# EAGLE board EARM01 (EAGLE 7.2.0)
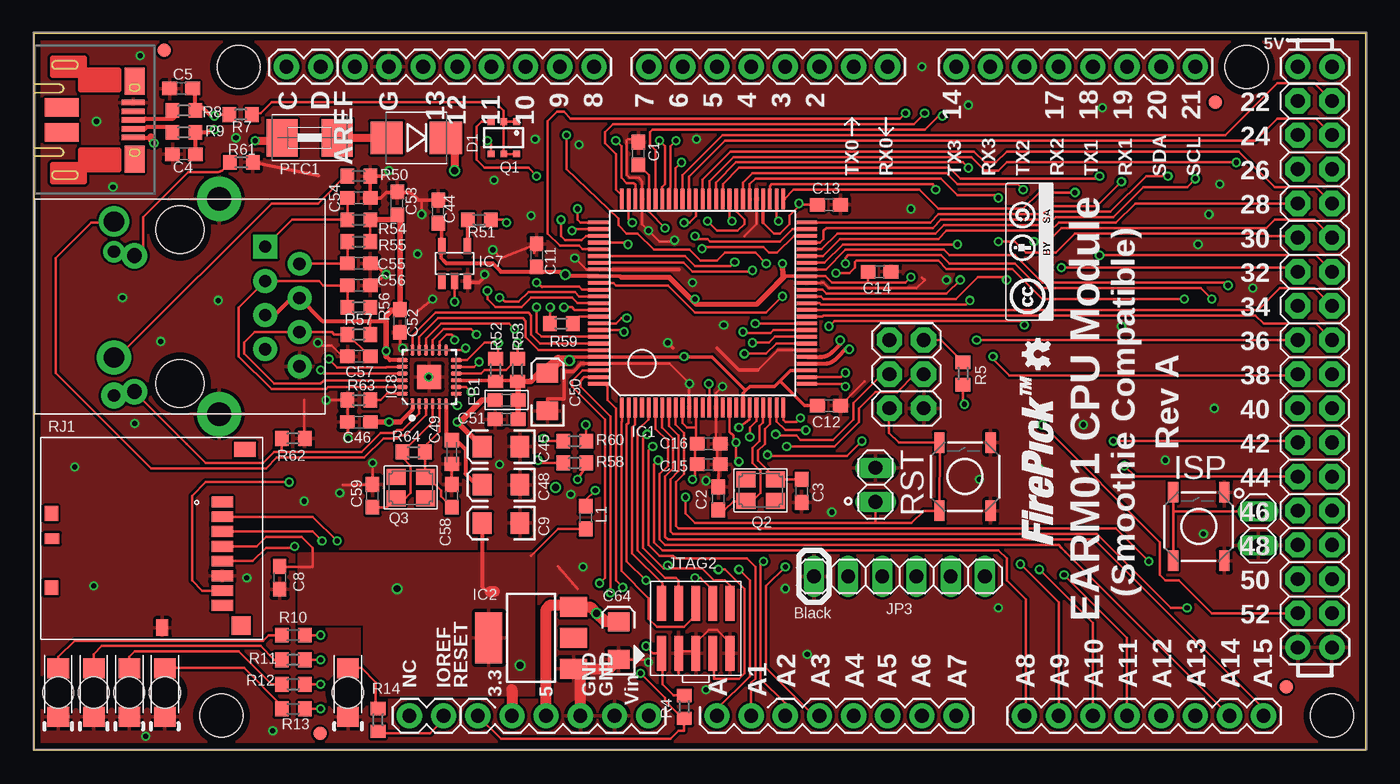
[diagram p2: board, top side]
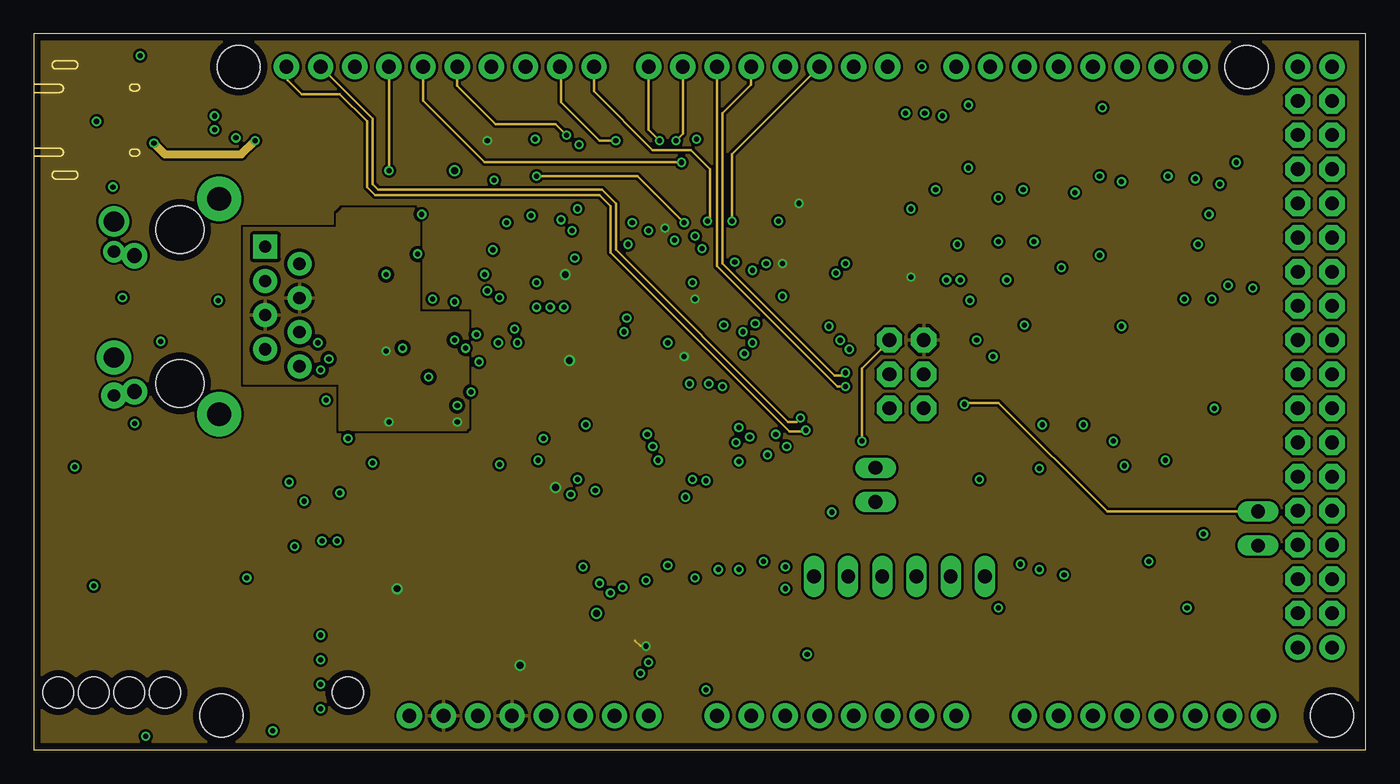
[diagram p3: board, inner layer 3.3]
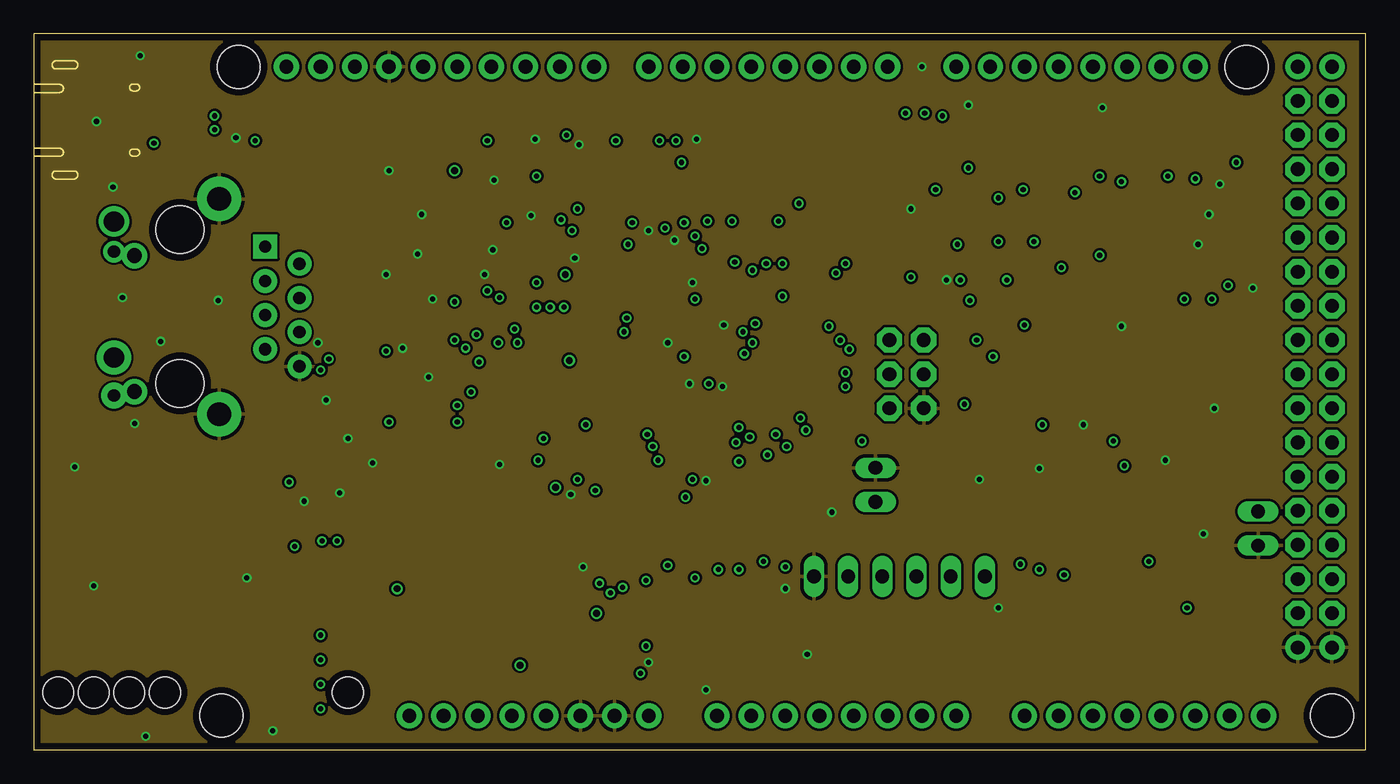
[diagram p4: board, inner layer Gnd]
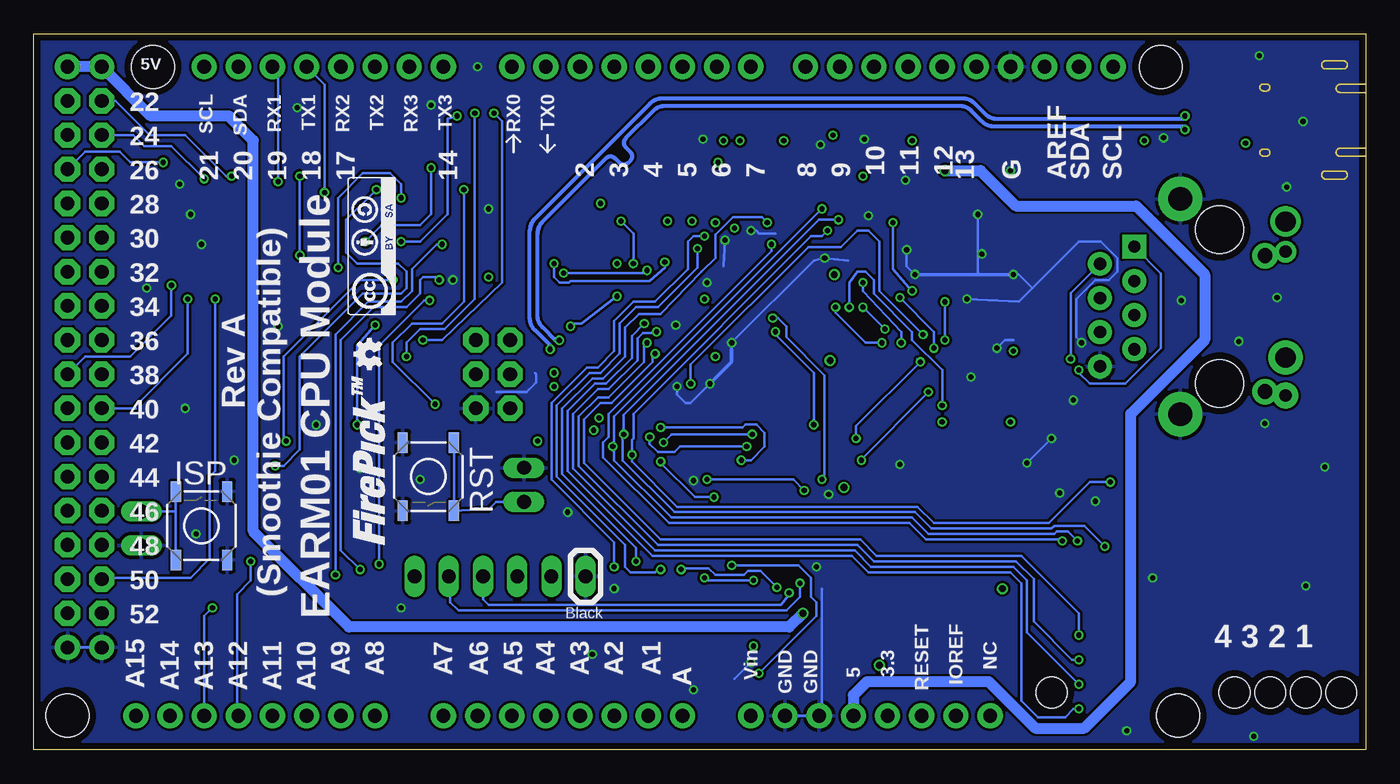
[diagram p5: board, bottom side, seen from below]

Size 99.04 x 53.26 mm. Coordinates in mm from the lower left corner, seen from the top.
Outline: 0,0 99.04,0 99.04,53.26 0,53.26 0,0
Copper layers (1*2*3*16): Top 0.035mm / dielectric 1.5mm / 3.3 0.035mm / dielectric 0.15mm / Gnd 0.035mm / dielectric 0.2mm / Bottom 0.035mm
Design rules "EagleRules": minimum track width 7mil, minimum drill 12mil, track to track 7mil, track to pad 7mil, pad to pad 7mil, via to via 7mil, smd to smd 0mil, copper to edge 20mil, drill to drill 10mil, minimum pad ring 10mil, minimum via ring 6mil, stop-mask expansion 2mil, vias tented up to drill 25mil, thermal gap 10mil
Net classes: 1 USB: width 0.305 mm, drill 0.381 mm, clearance 0.254 mm

## Footprints (pad centres in the part's own frame; a part is rotated, then mirrored left to right if it is on the bottom)
C0603 = smd 1.1 x 1: 1 -0.85,0; 2 0.85,0
EIA3216 = smd 1.4 x 1.6: A 1.4,0; C -1.4,0
C0603K = smd 1.05 x 1.08: 1 -0.875,0; 2 0.875,0
SMB-DIODE = smd 2.4 x 2.4: A 2.2,0; C -2.2,0
0603 = smd 1.1 x 1: 1 -0.85,0; 2 0.85,0
FIDUCIAL-1X2 = smd 1 x 1: 1 0,0
LQFP100 = smd 0.27 x 1.5: 1 -6,-7.75; 2 -5.5,-7.75; 3 -5,-7.75; 4 -4.5,-7.75; 5 -4,-7.75; 6 -3.5,-7.75; 7 -3,-7.75; 8 -2.5,-7.75; 9 -2,-7.75; 10 -1.5,-7.75; 11 -1,-7.75; 12 -0.5,-7.75; 13 0,-7.75; 14 0.5,-7.75; 15 1,-7.75; 16 1.5,-7.75; 17 2,-7.75; 18 2.5,-7.75; 19 3,-7.75; 20 3.5,-7.75; 21 4,-7.75; 22 4.5,-7.75; 23 5,-7.75; 24 5.5,-7.75; 25 6,-7.75; 51 6,7.75; 52 5.5,7.75; 53 5,7.75; 54 4.5,7.75; 55 4,7.75; 56 3.5,7.75; 57 3,7.75; 58 2.5,7.75; 59 2,7.75; 60 1.5,7.75; 61 1,7.75; 62 0.5,7.75; 63 0,7.75; 64 -0.5,7.75; 65 -1,7.75; 66 -1.5,7.75; 67 -2,7.75; 68 -2.5,7.75; 69 -3,7.75; 70 -3.5,7.75; 71 -4,7.75; 72 -4.5,7.75; 73 -5,7.75; 74 -5.5,7.75; 75 -6,7.75 | smd 1.5 x 0.27: 26 7.75,-6; 27 7.75,-5.5; 28 7.75,-5; 29 7.75,-4.5; 30 7.75,-4; 31 7.75,-3.5; 32 7.75,-3; 33 7.75,-2.5; 34 7.75,-2; 35 7.75,-1.5; 36 7.75,-1; 37 7.75,-0.5; 38 7.75,0; 39 7.75,0.5; 40 7.75,1; 41 7.75,1.5; 42 7.75,2; 43 7.75,2.5; 44 7.75,3; 45 7.75,3.5; 46 7.75,4; 47 7.75,4.5; 48 7.75,5; 49 7.75,5.5; 50 7.75,6; 76 -7.75,6; 77 -7.75,5.5; 78 -7.75,5; 79 -7.75,4.5; 80 -7.75,4; 81 -7.75,3.5; 82 -7.75,3; 83 -7.75,2.5; 84 -7.75,2; 85 -7.75,1.5; 86 -7.75,1; 87 -7.75,0.5; 88 -7.75,0; 89 -7.75,-0.5; 90 -7.75,-1; 91 -7.75,-1.5; 92 -7.75,-2; 93 -7.75,-2.5; 94 -7.75,-3; 95 -7.75,-3.5; 96 -7.75,-4; 97 -7.75,-4.5; 98 -7.75,-5; 99 -7.75,-5.5; 100 -7.75,-6
SOT223 = smd 1.5 x 2: 1 -2.3,-3.15; 2 0,-3.15; 3 2.3,-3.15 | smd 3.8 x 2: 4 0,3.15
SOT23-5 = smd 0.55 x 1.2: 1 -0.95,-1.3; 2 0,-1.3; 3 0.95,-1.3; 4 0.95,1.3; 5 -0.95,1.3
QFN24_4MM = smd 0.8 x 0.28: 1 -2,1.25; 2 -2,0.75; 3 -2,0.25; 4 -2,-0.25; 5 -2,-0.75; 6 -2,-1.25; 13 2,-1.25; 14 2,-0.75; 15 2,-0.25; 16 2,0.25; 17 2,0.75; 18 2,1.25 | smd 0.28 x 0.8: 7 -1.25,-2; 8 -0.75,-2; 9 -0.25,-2; 10 0.25,-2; 11 0.75,-2; 12 1.25,-2; 19 1.25,2; 20 0.75,2; 21 0.25,2; 22 -0.25,2; 23 -0.75,2; 24 -1.25,2 | smd 1.778 x 1.778: THERM 0,0
1X02 = drill 1.016 long: 1 -1.27,0; 2 1.27,0
1X06 = drill 1.016 long: 1 -6.35,0; 2 -3.81,0; 3 -1.27,0; 4 1.27,0; 5 3.81,0; 6 6.35,0
MICRO-USB-FCI-10103592 = smd 0.4 x 1.71: 1 3.84,2.51; 2 3.19,2.51; 3 2.54,2.51; 4 1.89,2.51; 5 1.24,2.51 | smd 2 x 1.46: 7 -0.36,2.64; 17 5.44,2.64 | smd 1.375 x 2.5: 11 1.603,-2.79; 12 3.478,-2.79
2X05_1.27MM_SMT = smd 0.65 x 2.6: 1 -2.54,-1.85; 2 -2.54,1.85; 3 -1.27,-1.85; 4 -1.27,1.85; 5 0,-1.85; 6 0,1.85; 7 1.27,-1.85; 8 1.27,1.85; 9 2.54,-1.85; 10 2.54,1.85
LED-1206-BOTTOM = smd 1.5 x 1.6: A -1.8,0; C 1.8,0 | hole 2.3: 0,0
1812 = smd 2.286 x 2.794: 1 -2.046,0; 2 2.046,0
SC74_INFINEON = smd 0.5 x 0.5: 1 -0.95,-1.2; 2 0,-1.2; 3 0.95,-1.2; 4 0.95,1.2; 5 0,1.2; 6 -0.95,1.2
CRYSTAL_3.2X2.5 = smd 1.4 x 1.2: 1 -1.1,-0.8; 2 1.1,0.8; GND1 -1.1,0.8; GND2 1.1,-0.8
R0603 = smd 1 x 1.1: 1 -0.85,0; 2 0.85,0
HR911105A = drill 1.5: G+ 6.325,4.9 | drill 0.9 pad 1.6: G- 4.085,4.9 | drill 1.1 pad 1.9: G-- 3.785,3.38; Y++ -6.325,3.38 | drill 0.9 pad 1.778: GND -4.445,-8.89; NC -3.175,-6.35; P4 0.635,-8.89; P5 -0.635,-6.35; RD+ 1.905,-6.35; RD- -1.905,-8.89; TD- 3.175,-8.89 | drill 1.76 pad 3.3: SHIELD0 -8.001,-2.921; SHIELD1 8.001,-2.921 | drill 0.9 pad 1.778 square: TD+ 4.445,-6.35 | drill 0.9 pad 1.93: Y+ -6.625,4.9 | drill 1.5 pad 2.54: Y- -3.785,4.9 | hole 3.556: 5.715,0; -5.715,0
TACTILE_SWITCH_SMD = smd 1.524 x 0.762: 1 -2.54,1.905; 2 2.54,1.905; 3 -2.54,-1.905; 4 2.54,-1.905
ARDUINO_MEGA_NEW = drill 1.016 pad 1.88: 0 63.5,50.8; 1 60.96,50.8; 2 58.42,50.8; 3 55.88,50.8; 3.3V 35.56,2.54; 4 53.34,50.8; 5 50.8,50.8; 5V 38.1,2.54; 5V@1 93.98,50.8; 5V@2 96.52,50.8; 6 48.26,50.8; 7 45.72,50.8; 8 41.656,50.8; 9 39.116,50.8; 10 36.576,50.8; 11 34.036,50.8; 12 31.496,50.8; 13 28.956,50.8; 14 68.58,50.8; 15 71.12,50.8; 16 73.66,50.8; 17 76.2,50.8; 18 78.74,50.8; 19 81.28,50.8; 20 83.82,50.8; 21 86.36,50.8; A0 50.8,2.54; A1 53.34,2.54; A2 55.88,2.54; A3 58.42,2.54; A4 60.96,2.54; A5 63.5,2.54; A6 66.04,2.54; A7 68.58,2.54; A8 73.66,2.54; A9 76.2,2.54; A10 78.74,2.54; A11 81.28,2.54; A12 83.82,2.54; A13 86.36,2.54; A14 88.9,2.54; A15 91.44,2.54; AREF 23.876,50.8; GND 26.416,50.8; GND@0 40.64,2.54; GND@1 43.18,2.54; GND@2 93.98,7.62; GND@3 96.52,7.62; IOREF 30.48,2.54; NC 27.94,2.54; RESET 33.02,2.54; SCL1 18.796,50.8; SDA1 21.336,50.8; VIN 45.72,2.54 | drill 1.016 pad 1.88 octagon: 22 93.98,48.26; 23 96.52,48.26; 24 93.98,45.72; 25 96.52,45.72; 26 93.98,43.18; 27 96.52,43.18; 28 93.98,40.64; 29 96.52,40.64; 30 93.98,38.1; 31 96.52,38.1; 32 93.98,35.56; 33 96.52,35.56; 34 93.98,33.02; 35 96.52,33.02; 36 93.98,30.48; 37 96.52,30.48; 38 93.98,27.94; 39 96.52,27.94; 40 93.98,25.4; 41 96.52,25.4; 42 93.98,22.86; 43 96.52,22.86; 44 93.98,20.32; 45 96.52,20.32; 46 93.98,17.78; 47 96.52,17.78; 48 93.98,15.24; 49 96.52,15.24; 50 93.98,12.7; 51 96.52,12.7; 52 93.98,10.16; 53 96.52,10.16; GNDI 66.167,25.4; MISO 63.627,30.48; MOSI 66.167,27.94; RST 63.627,25.4; SCK 63.627,27.94; VCC 66.167,30.48 | hole 3.2: 15.24,50.8; 13.97,2.54; 90.17,50.8; 96.52,2.54
ST9S008V4AR1500 = smd 0.8 x 1.6: 1 3.2,0; 2 2.1,0; 3 1,0; 4 -0.1,0; 5 -1.2,0; 6 -2.3,0; 7 -3.4,0; 8 -4.5,0 | smd 1.2 x 0.9: ID -6.15,4.45 | smd 1.4 x 1.4: P$9 -6,-1.4 | smd 1.1 x 1.6: P$10 7.1,-1.7 | smd 1.1 x 1: P$12 -3.18,12.7; P$13 2.35,12.7 | smd 0.8 x 1.1: P$14 0.46,12.65

## Placement (x,y rotation side)
C1  .1uF  [C0603]  44.96,44.35 270 top
C2  18pF  [C0603]  50.9,18.69 90 top
C3  18pF  [C0603]  57.1,19.25 270 top
C4  18pF  [C0603]  11.18,44.3 0 top
C5  18pF  [C0603]  10.97,49.17 0 top
C8  .1uF  [C0603]  18.29,12.8 270 top
C9  10uF  [EIA3216]  34.75,16.87 180 top
C11  .1uF  [C0603]  37.39,36.78 270 top
C12  .1uF  [C0603]  59.13,25.6 180 top
C13  .1uF  [C0603]  59.13,40.54 180 top
C14  .1uF  [C0603]  62.89,35.56 180 top
C15  .1uF  [C0603]  50.19,21.23 180 top
C16  .1uF  [C0603]  50.19,22.76 0 top
C44  .1uF  [C0603]  30.07,40.03 90 top
C45  10uF  [EIA3216]  34.75,22.56 180 top
C46  .1uF  [C0603]  24.18,24.38 180 top
C48  1uF  [EIA3216]  34.75,19.71 180 top
C49  470pF  [C0603K]  31.09,22.15 270 top
C50  10uF  [EIA3216]  38.2,26.62 90 top
C51  .1uF  [C0603]  35.15,24.59 180 top
C52  .1uF  [C0603]  27.23,31.9 270 top
C53  .1uF  [C0603]  27.03,40.64 90 top
C54  18pF  [C0603]  24.18,41.05 0 top
C55  18pF  [C0603]  24.18,36.17 0 top
C56  18pF  [C0603]  24.18,34.54 0 top
C57  18pF  [C0603]  24.18,29.26 180 top
C58  18pF  [C0603]  31.09,18.9 90 top
C59  18pF  [C0603]  25.2,18.9 90 top
C64  10uF  [EIA3216]  43.48,8.13 90 top
D1  DIODE-SMB  [SMB-DIODE]  28.45,45.52 180 top
FB1  [0603]  35.15,26.01 180 top
FID5  FIDUCIAL1X2  [FIDUCIAL-1X2]  93.12,4.67 0 top
FID6  FIDUCIAL1X2  [FIDUCIAL-1X2]  21.29,1.22 0 top
FID17  FIDUCIAL1X2  [FIDUCIAL-1X2]  87.83,48.16 0 top
FID18  FIDUCIAL1X2  [FIDUCIAL-1X2]  9.7,52.02 0 top
IC1  LPC1769  [LQFP100]  49.73,33.22 0 top
IC2  LD1117  [SOT223]  36.98,8.33 90 top
IC7  [SOT23-5]  31.29,36.17 0 top
IC8  [QFN24_4MM]  29.41,27.74 90 top
JP1  [1X02]  62.59,19.71 270 top
JP2  [1X02]  91.03,16.46 270 top
JP3  [1X06]  64.36,12.9 0 top
JP4  MICRO-USB-FCI-10103592  [MICRO-USB-FCI-10103592]  4.88,49.38 270 top
JTAG2  [2X05_1.27MM_SMT]  49.23,9.04 0 top
L1  [0603]  41.05,17.27 270 top
LED1  [LED-1206-BOTTOM]  1.83,4.27 270 top
LED2  [LED-1206-BOTTOM]  4.47,4.27 270 top
LED3  [LED-1206-BOTTOM]  7.11,4.27 270 top
LED4  [LED-1206-BOTTOM]  9.75,4.27 270 top
LED5  [LED-1206-BOTTOM]  23.37,4.27 270 top
LOGO1  LOGO-FIREPICKMEDIUM  [LOGO-FIREPICK-MEDIUM]  72.95,15.24 90 bottom
LOGO2  LOGO-OSHWSMALL  [LOGO-OSHW-SMALL]  72.95,28.19 90 bottom
LOGO3  LOGO-CC-BY-SAMEDIUM  [LOGO-CC-BY-SA-MEDIUM]  72.14,32.36 90 bottom
LOGO4  LOGO-FIREPICKMEDIUM  [LOGO-FIREPICK-MEDIUM]  75.79,15.24 90 top
LOGO6  LOGO-CC-BY-SAMEDIUM  [LOGO-CC-BY-SA-MEDIUM]  75.79,31.95 90 top
LOGO10  LOGO-OSHWSMALL  [LOGO-OSHW-SMALL]  75.79,28.19 90 top
PTC1  [1812]  20.52,45.52 180 top
Q1  BSL207SP  [SC74_INFINEON]  34.95,45.52 180 top
Q2  12MHz  [CRYSTAL_3.2X2.5]  54.05,19.3 180 top
Q3  25MHz  [CRYSTAL_3.2X2.5]  28.04,19.51 0 top
R4  10k  [R0603]  48.36,3.2 90 top
R5  10k  [R0603]  69.09,27.99 90 top
R7  1.5K  [R0603]  15.39,47.24 0 top
R8  33R  [R0603]  11.18,47.55 0 top
R9  33R  [R0603]  11.18,45.92 0 top
R10  1k  [R0603]  19.3,8.53 0 top
R11  1k  [R0603]  19.3,6.71 0 top
R12  1k  [R0603]  19.3,4.88 0 top
R13  1k  [R0603]  19.3,3.05 0 top
R14  1k  [R0603]  25.6,2.24 270 top
R50  330R  [R0603]  24.18,42.67 180 top
R51  22R  [R0603]  33.12,39.42 0 top
R52  1.5K  [R0603]  34.34,28.24 270 top
R53  10K  [R0603]  35.97,28.24 270 top
R54  49.9R  [R0603]  24.18,39.42 180 top
R55  49.9R  [R0603]  24.18,37.8 180 top
R56  49.9R  [R0603]  24.18,32.92 180 top
R57  49.9R  [R0603]  24.18,30.89 180 top
R58  22R  [R0603]  40.23,21.34 0 top
R59  22R  [R0603]  39.22,31.7 0 top
R60  22R  [R0603]  40.23,22.96 0 top
R61  330R  [R0603]  15.44,43.69 180 top
R62  10K  [R0603]  19.3,23.16 180 top
R63  12.1K  [R0603]  24.18,26.01 0 top
R64  1M  [R0603]  28.24,22.15 180 top
RJ1  HR911105A  [HR911105A]  10.87,32.97 90 top
S1  [TACTILE_SWITCH_SMD]  69.24,20.32 90 top
S2  [TACTILE_SWITCH_SMD]  86.61,16.61 90 top
S3  [TACTILE_SWITCH_SMD]  69.7,20.32 270 bottom
S4  [TACTILE_SWITCH_SMD]  86.56,16.66 90 bottom
U1  ARDUINO-MEGA  [ARDUINO_MEGA_NEW]  0,0 0 top
X1  ST9S008V4AR1500  [ST9S008V4AR1500]  14.02,15.24 90 top

## Tracks (layer width: path | path; a pad name or v marks a point on that pad's centre or on a via)
3.3V  (via drill 0.38, 0.51)
  Top 0.203: 33.73,11.99 33.93,11.79 33.93,11.58 33.36,12.15 | 33.93,8.43 IC2.4 | R4.2 47.56,4.05 46.74,4.88 46.74,7.14 JTAG2.1 46.05,7.19 v45.52,7.72 | IC1.42 58.86,35.22 59.33,34.75 61.98,34.75 | 55.85,35.22 55.75,35.22 | C1.2 45.73,42.72 IC1.71 45.73,40.02 v46.94,38.81 | 54.23,39.22 55.05,38.41 55.47,38.41 56.19,39.12 56.19,39.73 56.9,40.44 | 56.9,40.44 v56.9,40.64 | 56.9,40.44 57,40.54 C13.2 | 47.75,34.65 47.8,34.59 | 49.28,33.12 49.28,33.43 v49.17,33.53 | U1.VCC 67.45,30.48 R5.2 | 61.98,34.75 64.82,34.75 v65.23,35.15 | Q1.4 34,45.04 v33.73,45.31 | C14.2 62.04,34.81 61.98,34.75 | U1.IOREF 30.48,2.23 29.46,1.22 25.77,1.22 R14.2 | X1.4 16.56,15.14 17.27,15.85 19.91,15.85 20.73,15.04 20.73,13.61 18.32,13.61 C8.1 | L1.2 38.98,16.42 36.98,14.43
  Top 0.254: IC8.9 34.34,27.49 | 34.34,27.49 35.87,27.49 R53.2 | R52.2 34.34,27.49 | 30.48,36.37 30.28,36.58 30.28,37.4 IC7.5 30.34,38.91 C44.1 | v39.83,28.96 40.09,29.22 IC1.96 50.43,29.22 52.93,26.72 | C12.2 57.3,25.6 55.47,27.43 | IC1.19 52.73,26.52 52.93,26.72 | 52.93,26.72 53.24,27.03 55.07,27.03 55.47,27.43 | 55.47,27.43 56.27,28.22 IC1.28 | IC1.42 55.85,35.22 | IC1.54 54.23,39.22 | IC1.84 43.62,35.22 43.69,35.15
  Top 0.305: 55.85,35.22 55.78,35.15 | 30.48,36.37 30.68,36.17 34.14,36.17 34.75,35.56 37.39,35.56 | 37.39,35.56 39.12,35.56 v39.52,35.36 | C11.2 37.39,35.56 | IC1.84 39.35,35.22 39.22,35.36 | C9.A 33.35,12.17 33.36,12.15
  Top 0.356: 55.78,35.15 54.7,34.07 53.75,33.12 49.28,33.12 47.8,34.59 47.24,35.15 43.69,35.15
  Top 0.406: 37.98,28.04 C50.A 38.18,28.04 37.82,28.04 37.59,28.04 36.95,27.39 R53.2 36,27.36 FB1.1 C51.1 | 54.7,34.07 55.72,35.12 v55.68,36.17
  Top 0.813: C50.A 37.82,28.04 39.01,28.96 v39.83,28.96 | 35.56,4.47 U1.3.3V | 33.93,11.79 34.26,11.79
  3.3 0.203: v45.52,7.72 45.11,7.72 44.7,8.13
  Bottom 0.203: 35.56,1.83 U1.3.3V | 48.87,33.53 v49.17,33.53
  other vias: 38.81,19.51 27.03,11.99 36.17,6.3 48.36,29.26 36.17,6.3 36.17,6.3
  pour Top: 19.71,14.63 37.19,14.63 37.19,4.06 24.59,4.06 24.59,9.35 19.71,9.35
  pour 3.3 (rank 2): 0,53.44 99.16,53.44 99.16,0 0,0
5V  (via drill 0.51)
  Top 0.61: 31.29,44.7 v31.29,43.08
  Top 0.813: U1.5V 38.1,10.46 38.41,10.77 40.07,10.77 IC2.3 41.39,10.63 v41.86,10.16 42.47,9.55 43.46,9.55 C64.A | D1.C 30.68,45.31 31.29,44.7
  Bottom 0.813: U1.5V@2 U1.5V@1 90.32,47.14 84.53,47.14 82.7,45.31 82.7,16.26 75.59,9.14 42.88,9.14 v41.86,10.16 | v31.29,43.08 28.65,43.08 26.01,40.44 17.07,40.44 11.99,35.36 11.99,30.48 17.48,24.99 17.48,5.08 20.93,1.63 24.59,1.63 28.04,5.08 37.08,5.08 38.1,4.06 U1.5V
!EN1  (via drill 0.38)
  Top 0.203: v60.35,36.17 60.35,36.58 60.55,36.78 67.46,36.78 68.07,36.17 72.95,36.17 74.78,34.34 86.77,34.34 v87.58,33.53 | v52.12,36.27 51.82,35.97 49.17,35.97 48.42,36.72 IC1.81
  Bottom 0.203: v60.35,36.17 60.35,35.15 59.94,34.75 59.23,34.75 59.13,34.85 53.24,34.85 52.12,35.87 v52.12,36.27 | 91.44,25.4 91.64,25.4 | 91.64,25.4 U1.40 | v87.58,33.53 87.58,29.46 91.64,25.4
!EN2  (via drill 0.38)
  Top 0.203: U1.A0 50.8,3.05 53.24,5.49 53.24,12.6 v52.43,13.41 | IC1.48 56.51,38.22 55.27,36.98 54.66,36.98 54.25,37.39 49.78,37.39 v49.68,37.29
  Bottom 0.203: v52.43,13.41 52.63,13.41 52.83,13.21 54.66,13.21 55.07,13.61 55.07,15.24 60.15,20.32 60.15,25.6 57.71,28.04 56.9,28.04 55.47,29.46 55.47,31.7 54.25,32.92 52.63,32.92 49.68,35.87 v49.68,37.29
!EN3  (via drill 0.38)
  Top 0.203: IC1.59 51.73,39.5 v51.92,39.32
  3.3 0.203: U1.2 51.92,44.3 v51.92,39.32
!EN4  (via drill 0.38)
  Top 0.203: IC1.57 52.73,42.17 53.44,42.88 67.87,42.88 68.68,42.06 73.15,42.06 v73.56,41.66 | U1.44 81.89,20.32 v81.08,21.13
  Bottom 0.203: v73.56,41.66 75.79,39.42 75.79,36.98 74.98,36.17 71.93,36.17 71.32,35.56 71.32,34.34 71.73,33.93 74.57,33.93 79.25,29.26 79.25,22.35 80.47,21.13 v81.08,21.13
!PS_ON
  Top 0.203: IC1.45 58.67,36.72 59.94,38 67.26,38 67.87,38.61 75.59,38.61 76.2,39.22 80.47,39.22 81.89,40.64 U1.28
!RST  (via drill 0.38)
  Top 0.203: JTAG2.10 51.77,12.24 51.41,12.6 50.6,12.6 49.68,13.51 47.14,13.51 | IC1.17 51.73,23.65 52.02,23.37 52.02,23.06 v52.22,22.86 52.22,21.64 v52.43,21.44 | v45.62,23.47 45.31,23.16 45.31,15.04 46.84,13.51 47.14,13.51 | v45.11,5.69 46.94,3.86 46.94,3.66 48.16,2.44 48.36,2.44 R4.1 48.36,1.42 47.95,1.42 47.35,0.81 34.75,0.81 U1.RESET | v47.14,13.72 47.14,13.51 | v48.46,18.8 48.46,17.58 49.17,16.87 62.59,16.87 | 62.59,16.87 65.25,16.87 66.17,17.78 S1.1 67.36,22.78 S1.2 64.31,22.86 63.6,23.57 63.6,25.38 U1.RST | JP1.2 62.59,16.87
  Bottom 0.203: v45.11,5.69 40.84,9.96 40.84,10.97 41.25,11.38 41.25,12.8 42.16,13.72 v47.14,13.72 | v45.62,23.47 51.61,23.47 v52.22,22.86 | v52.43,21.44 52.43,21.34 49.89,18.8 v48.46,18.8 | JP1.2 64.67,18.44 65.23,17.88 66.06,17.88 S3.2 S3.1
!RSTOUT  (via drill 0.38)
  Top 0.203: IC8.15 29.66,30.48 30.48,31.29 32.51,31.29 v32.92,30.89 | IC1.14 50.23,27.19 v50.19,27.23
  Bottom 0.203: v32.92,30.89 36.17,34.14 36.17,37.8 36.98,38.61 37.8,38.61 39.01,37.39 41.45,37.39 50.19,28.65 v50.19,27.23
!TOOL2_EN  (via drill 0.38)
  Top 0.203: v59.13,31.5 59.54,31.9 73.36,31.9 v73.66,31.6 | v55.68,33.73 54.46,32.51 49.17,32.51 47.14,34.54 43.28,34.54 43.1,34.72 IC1.85 | U1.52 87.58,10.16 85.14,12.6 84.12,12.6 83.72,13.01 83.72,15.44 v74.98,24.18
  Bottom 0.203: v55.68,33.73 58.32,31.7 58.93,31.7 v59.13,31.5 | v74.98,24.18 74.98,30.07 v73.66,31.6
!TOOL3_EN  (via drill 0.38)
  Top 0.203: IC1.46 58.56,37.22 59.74,38.41 67.06,38.41 67.67,39.01 75.39,39.01 76,39.62 80.26,39.62 82.5,41.86 85.75,41.86 v86.36,42.47
  Bottom 0.203: U1.24 91.64,45.72 90.83,44.91 88.8,44.91 v86.36,42.47
!TOOL4_EN  (via drill 0.38)
  Top 0.203: IC1.50 58.31,39.22 58.32,39.22 66.65,39.22 67.26,39.83 74.98,39.83 75.59,40.44 79.05,40.44 v80.87,42.27
  Bottom 0.203: v80.87,42.27 80.87,50.39 U1.19
AVCC  (via drill 0.38)
  Top 0.203: IC1.12 49.23,23.98 | 49.23,23.98 49.23,22.85 C16.1 49.17,22.76 49.17,21.13 C15.2 49.17,21.1 49.17,20.32 v48.97,20.12 | IC1.10 48.23,24.31 48.56,23.98 49.23,23.98 | L1.1 41.05,18.59 v41.76,19.3
  Bottom 0.203: v41.76,19.3 42.57,20.12 v48.97,20.12
D13_LED  (via drill 0.38)
  Top 0.203: IC1.67 47.73,43.26 v48.16,43.69
  3.3 0.203: U1.13 28.96,48.26 33.53,43.69 v48.16,43.69
DIR1  (via drill 0.38)
  Top 0.203: IC1.80 40.81,37.22 40.54,37.49 39.12,37.49 38.2,38.41 38.2,46.74 38.91,47.45 39.42,47.45 39.93,46.94 64.41,46.94 v64.82,47.35 | v70.1,30.48 U1.36
  Bottom 0.203: v70.1,30.48 68.68,30.48 64.21,34.75 64.21,46.74 v64.82,47.35
DIR2  (via drill 0.38)
  Top 0.203: U1.A3 58.01,2.54 54.46,6.1 54.46,12.19 v55.88,13.61 | IC1.49 56.4,38.72 55.47,37.8 50.29,37.8 50.09,38 49.17,38 v49.17,38.2
  Bottom 0.203: v55.88,13.61 55.88,15.44 60.55,20.12 60.55,25.81 57.91,28.45 57.1,28.45 55.88,29.67 55.88,31.9 54.46,33.33 52.83,33.33 50.39,35.76 50.39,37.8 49.99,38.2 v49.17,38.2
DIR3  (via drill 0.38)
  Top 0.203: IC1.58 52.23,40.02 52.83,39.42 52.83,39.12 52.32,38.61 50.8,38.61 v50.09,39.32
  3.3 0.203: U1.8 41.66,48.97 46.02,44.6 48.87,44.6 50.29,43.18 50.29,39.52 v50.09,39.32
  Bottom 0.203: v50.09,39.32 50.19,39.22
DIR4  (via drill 0.38)
  Top 0.203: IC1.56 53.23,42.06 53.65,42.47 67.46,42.47 68.68,41.25 71.53,41.25 v71.73,41.05 | v76.4,35.87 93.67,35.87 U1.32
  Bottom 0.203: v71.73,41.05 71.73,42.06 72.54,42.88 74.57,42.88 76.4,41.05 v76.4,35.87
ENET_CRS  (via drill 0.38)
  Top 0.203: IC1.92 43.76,31.22 v43.89,31.09 | R60.2 41.08,24.42 v41.05,24.18
  Bottom 0.203: v41.05,24.18 41.05,28.04 43.89,30.89 v43.89,31.09
ENET_MDC  (via drill 0.38)
  Top 0.203: IC8.13 31.97,29.74 v32.11,29.87 | v34.65,33.63 34.64,33.62 35.04,33.33 36.07,33.33 36.78,34.04 40.23,34.04 40.55,33.72 IC1.87
  Bottom 0.203: v32.11,29.87 32.11,31.09 v34.65,33.63
ENET_MDIO  (via drill 0.38)
  Top 0.203: IC8.12 32.24,28.99 33.53,30.28 v34.54,30.28 34.54,29.3 R52.1 | v37.39,34.75 37.78,34.43 37.8,34.44 40.54,34.44 40.76,34.22 IC1.86
  Bottom 0.203: v34.54,30.28 34.54,31.09 37.39,34.14 v37.39,34.75
ENET_REF_CLK  (via drill 0.38)
  Top 0.203: IC1.88 40.44,33.22 40.03,33.63 36.98,33.63 36.27,32.92 34.34,32.92 33.73,33.53 v33.73,34.14 | R51.2 34.95,39.42 v35.15,39.22
  Bottom 0.203: v35.15,39.22 35.15,35.76 v33.73,34.14
ENET_RX_ER  (via drill 0.38)
  Top 0.203: IC1.89 40.23,32.72 40.03,32.92 v39.42,32.92 | IC8.10 33.27,27.99 33.53,28.25 35.12,28.25 R53.1 v35.97,30.28
  Bottom 0.203: v39.42,32.92 39.42,32.51 37.19,30.28 v35.97,30.28
ENET_RXD0  (via drill 0.38)
  Top 0.203: IC1.91 43.31,31.72 43.69,32.11 v44.09,32.11 | R58.2 40.84,20.73 v40.44,20.12
  Bottom 0.203: v40.44,20.12 40.23,20.52 40.23,27.84 43.08,30.68 43.08,31.5 43.69,32.11 v44.09,32.11
ENET_RXD1
  Top 0.203: IC1.90 40.59,32.22 R59.2
ENET_TX_EN  (via drill 0.38)
  Top 0.203: IC8.16 29.16,30.59 30.28,31.7 35.36,31.7 v35.76,31.29 | IC1.93 37.76,30.72 37.39,31.09 v37.39,32.92
  Bottom 0.203: v35.76,31.29 v37.39,32.92
ENET_TXD0
  Top 0.203: IC8.17 28.66,30.7 30.07,32.11 36.37,32.11 36.58,31.9 36.58,30.68 37.54,29.72 IC1.95
ENET_TXD1
  Top 0.203: IC8.18 28.16,30.8 29.87,32.51 36.78,32.51 36.98,32.31 36.98,30.89 37.65,30.22 IC1.94
ESTOP  (via drill 0.38)
  Top 0.203: IC1.52 55.23,39.46 v55.37,39.32 | v54.46,36.17 53.65,36.98 51.41,36.98 50.8,36.37 49.58,36.37 48.77,37.19 46.13,37.19 44.91,38.41 44.09,38.41 43.48,39.01 43.48,39.52 39.62,43.18 v39.62,45.72
  3.3 0.203: U1.12 31.5,49.38 34.34,46.53 38.81,46.53 v39.62,45.72
  Bottom 0.203: v55.37,39.32 54.46,38.41 v54.46,36.17
GND  (via drill 0.38)
  Top 0.203: 25.4,34.14 C56.2 25.2,34.54 v26.21,35.36 25.2,36.17 C55.2 | C57.2 22.96,29.26 22.15,30.07 21.34,30.07 | v21.74,26.01 R63.1 C46.2 23.37,24.38 v23.37,23.16 | C49.2 C58.2 | 21.13,42.67 R61.1 | v28.85,39.83 28.85,40.88 | 21.34,30.07 v21.13,30.28 | 21.34,30.07 21.31,30.07 | 27.23,31.29 C52.2 27.23,30.07 v27.43,29.87 | v29.67,33.53 28.45,32.51 | 20.12,26.01 20.12,23.16 R62.1 | v25.2,21.34 C59.2 25.2,19.71 22.96,19.71 | 49.17,7.32 47.95,7.32 JTAG2.3 47.95,5.69 | 49.17,7.32 49.17,7.92 50.19,8.94 50.8,8.94 51.82,7.92 51.82,7.32 JTAG2.9 | 49.17,7.32 JTAG2.5 | 38.99,13.64 40.44,11.99 | v45.72,6.5 45.52,6.71 43.69,6.71 C64.C | IC1.31 55.33,29.72 53.85,28.25 | C2.2 50.9,20.99 C15.1 50.8,21.13 50.8,22.76 C16.2 50.73,22.86 IC1.15 50.73,26.55 v51.21,27.03 | IC1.11 48.73,27.19 v48.77,27.23 47.27,28.72 IC1.97 | 61.77,27.39 C12.1 | IC1.41 58.5,34.72 58.52,34.75 58.73,34.75 59.13,34.34 65.63,34.34 66.24,34.95 66.04,35.12 | IC1.55 53.73,39.1 52.83,38.2 | v34.14,37.19 34.75,36.58 C11.1 37.19,36.95 | IC1.83 41.09,35.72 v40.23,36.58 | C1.1 44.94,45.41 44.2,45.41 44.09,45.31 44.09,42.77 44.3,42.57 45.01,42.57 45.23,42.24 IC1.72 45.23,39.09 v45.72,38.61 46.53,37.8 47.55,37.8 v47.65,37.9
  Top 0.254: C44.2 28.85,40.88 28.61,40.88 28.04,41.45 27.06,41.45 C53.2 26.99,41.45 26.21,41.45 25.81,41.05 C54.2 R50.1 | R61.1 21.17,42.71 | 24.99,42.71 R50.1 | v33.53,35.36 33.53,35.15 33.12,34.75 32.37,34.75 IC7.3 | R50.1 26.01,42.67 v26.42,43.08 | IC1.97 40.71,28.72 40.13,28.14 39.52,28.14 39.42,28.04 39.42,26.11 38.2,26.11 C50.C | 53.85,28.25 52.43,28.25 50.8,29.87 | 47.55,29.87 v47.14,30.28 | IC1.83 47.99,35.72
  Top 0.813: U1.GND@0 40.64,5.73 IC2.1 42.79,6.03 C64.C
  3.3 0.203: U1.GND v26.42,43.08
  Bottom 0.203: v28.85,39.83 28.85,35.36 | v29.67,33.53 25.81,33.33 24.79,34.34 | 24.79,34.34 21.34,37.8 19.71,37.8 18.49,36.58 18.49,35.56 19.1,34.95 20.12,34.95 21.54,33.53 21.54,30.68 v21.13,30.28 | 24.79,34.34 26.01,35.56 v26.21,35.36 | v25.2,21.34 v23.37,23.16 | v27.43,29.87 26.82,30.48 26.21,30.48 | 40.44,11.99 40.44,2.74 U1.GND@0 U1.GND@1 | v45.72,6.5 46.94,5.28 | U1.GND@3 U1.GND@2 93.88,7.52 | v51.21,27.03 51.21,26.42 50.6,25.81 50.19,25.81 v48.77,27.23 | 64.62,26.62 62.38,26.62 61.69,27.31 61.69,27.96 61.77,28.04 | v34.14,37.19 34.14,35.97 v33.53,35.36 | v47.14,30.28 41.05,36.37 v40.23,36.58 38.51,36.37 | v45.72,38.61 45.31,38.61 45.11,38.41 43.89,38.41 | v47.65,37.9 47.75,35.97
  Bottom 0.254: v26.21,35.36 28.85,35.36 v33.53,35.36 | v47.14,30.28 47.14,28.85 v48.77,27.23
  other vias: 49.99,4.47 66.04,50.8 48.97,34.75 36.98,39.73 69.49,47.96 88.19,42.06 87.38,39.83 86.56,37.59 80.87,31.5 87.78,25.4 84.12,21.54 78.03,24.18 74.78,20.93 70.31,20.12 59.33,17.68 55.88,11.99 57.51,7.11 71.73,10.57 86.97,16.05 4.47,12.19 7.52,24.28 3.05,21.03 17.78,1.42 22.76,19.1 29.36,27.74 51.31,31.6 49.28,45.42 40.54,45.01 37.29,45.42 34.24,42.37 28.55,36.88 6.6,33.63 13.72,33.43 9.45,30.38 34.65,21.23 67.87,34.95 39.93,19 49.99,20.02 40.84,13.61 90.63,34.34 79.45,47.75 65.23,40.23 15.04,45.52 5.89,41.86 4.67,46.74 8.33,1.02 20.12,18.49 15.85,12.8 7.92,51.61
  pour Top (rank 2): 0,53.24 99.16,53.24 99.16,0 0,0
  pour Bottom: 0,53.44 99.16,53.44 99.16,0 0,0
  pour Gnd: 0,53.44 99.16,53.44 99.16,0 0,0
ISENSE  (via drill 0.38)
  Top 0.203: v46.43,21.54 46.13,21.23 46.13,15.44 46.74,14.83 71.73,14.83 72.34,14.22 72.34,12.6 73.76,11.18 73.76,2.64 U1.A8 | IC1.20 53.23,24.58 v52.43,23.98
  Bottom 0.203: v52.43,23.98 46.33,23.98 46.13,24.18 45.31,24.18 44.7,23.57 44.7,22.55 45.72,21.54 v46.43,21.54
ISP_BOOT  (via drill 0.38)
  Top 0.203: IC1.53 54.73,41.93 54.86,42.06 66.85,42.06 v67.06,41.66 | R5.1 69.09,25.81 v69.19,25.7 | S2.2 84.71,17.68 | 84.71,17.68 S2.1 | JP2.1 84.76,17.73 84.71,17.68
  3.3 0.203: JP2.1 79.81,17.73 71.73,25.81 69.29,25.81 v69.19,25.7
  Bottom 0.203: v67.06,41.66 67.06,33.33 68.68,31.7 70.92,31.7 72.34,30.28 72.34,28.85 v69.19,25.7 | S4.1 S4.2 88.47,17.86 88.59,17.73 JP2.1
LED1  (via drill 0.38)
  Top 0.203: IC1.32 55.22,30.22 54.46,29.46 v52.83,29.46 | R10.2 v21.34,8.53
  Bottom 0.203: v52.83,29.46 53.03,29.26 53.03,28.85 56.08,25.81 56.9,25.81 58.12,24.59 58.12,21.34 52.43,15.65 37.59,15.65 36.37,14.43 25.6,14.43 21.34,10.16 v21.34,8.53
LED1/REGOFF
  Top 0.203: IC8.3 29.16,24.9 27.64,23.37 27.23,23.37 27.03,23.16 26.01,23.16 24.59,21.74 18.09,21.74 17.27,20.93 8.74,20.93 1.63,28.04 1.63,36.58 4.27,39.22 5.89,39.22 RJ1.G+
LED2  (via drill 0.38)
  Top 0.203: IC1.33 55.11,30.72 54.66,30.28 v53.44,30.28 | R11.2 v21.34,6.71
  Bottom 0.203: v53.44,30.28 53.65,30.07 53.65,28.85 56.29,26.21 57.1,26.21 58.52,24.79 58.52,21.13 52.63,15.24 37.8,15.24 36.58,14.02 26.01,14.02 24.69,12.7 24.69,9.55 21.84,6.71 v21.34,6.71
LED2/NINTSEL
  Top 0.203: RJ1.Y+ 7.19,26.34 RJ1.Y++ 11.38,22.76 12.8,21.34 17.07,21.34 17.88,22.15 18.49,22.15 | IC8.2 28.66,25.01 27.43,23.77 27.03,23.77 26.82,23.57 25.81,23.57 24.38,22.15 18.49,22.15 | R62.2 18.45,22.19 18.49,22.15
LED3  (via drill 0.38)
  Top 0.203: IC1.34 55,31.22 54.76,30.99 52.83,30.99 v52.73,31.09 | R12.2 v21.34,4.88
  Bottom 0.203: v52.73,31.09 52.83,30.99 53.75,30.99 54.15,30.58 54.15,28.96 56.29,26.82 57.1,26.82 58.93,24.99 58.93,20.93 52.83,14.83 38,14.83 36.78,13.61 26.21,13.61 25.2,12.6 25.2,8.74 v21.34,4.88
LED4  (via drill 0.38)
  Top 0.203: IC1.35 53.87,31.72 v53.65,31.7 | R13.2 v21.34,3.05
  Bottom 0.203: v53.65,31.7 54.56,30.79 54.56,29.16 56.49,27.23 57.3,27.23 59.33,25.2 59.33,20.73 53.03,14.43 38.2,14.43 36.98,13.21 26.42,13.21 25.6,12.39 25.6,3.66 24.38,2.44 22.35,2.44 21.74,3.05 v21.34,3.05
N$1
  Top 0.203: IC1.22 54.23,24.36 53.95,24.08 53.95,22.96 53.44,22.45 53.44,21.34 54.05,20.73 54.05,19.1 53.45,18.5 Q2.2 | 52.66,18.59 Q2.2 | C2.1 51.37,17.84 52.02,18.49 52.94,18.49 Q2.2
N$2
  Top 0.203: IC1.23 54.73,24.25 54.36,23.88 54.36,22.76 53.85,22.25 53.85,21.54 55.15,20.24 Q2.1 56.69,20.1 C3.1 57.1,19.7
N$3  (via drill 0.38)
  Top 0.203: IC8.11 32.75,28.49 v33.12,28.85 | R60.1 38.1,22.96 v37.9,23.16
  Bottom 0.203: 33.33,29.06 v33.12,28.85 37.9,24.08 v37.9,23.16
N$4
  Top 0.203: IC8.24 26.28,26.49 25.81,26.01 R63.2
N$9  (via drill 0.38)
  Top 0.305: JP4.1 8.72,45.54 | 18.27,45.31 PTC1.2
  Top 0.61: 8.72,45.54 v8.94,45.11 | v16.46,45.31 18.27,45.31
  3.3 0.61: v8.94,45.11 9.75,44.3 15.44,44.3 v16.46,45.31
N$12
  Top 0.305: IC8.6 30.66,23.45 C49.1 31.43,23.02 32.11,22.35 32.11,20.52 32.92,19.71 C48.A
N$15  (via drill 0.38)
  Top 0.203: IC8.14 30.16,30.37 30.68,30.89 31.09,30.89 31.29,30.68 v31.29,30.48 | v31.29,33.33 IC7.2
  Bottom 0.203: v31.29,30.48 v31.29,33.33
N$20
  Top 0.203: RJ1.G- 7.19,37.05 RJ1.G-- 8.13,37.39 8.13,39.62 11.48,42.98 13.72,42.98 14.02,43.08 R61.2
N$42  (via drill 0.38)
  Top 0.203: IC8.8 32.14,26.99 v32.51,26.62 | R58.1 37.69,21.34 v37.49,21.54
  Bottom 0.203: v37.49,21.54 37.59,21.54 v32.51,26.62
N$47
  Top 0.203: R50.2 23.16,42.67 21.13,40.64 17.68,40.64 6.91,29.87 6.66,29.87 RJ1.Y-
N$51
  Top 0.178: R7.2 16.85,47.33 16.87,47.35
  Top 0.203: Q1.2 Q1.1 | Q1.6 Q1.5 Q1.2 | 16.87,47.35 17.68,48.16 34.34,48.16 34.95,47.55 Q1.2
N$55  (via drill 0.38)
  Top 0.203: IC8.7 31.41,25.69 | v38.41,32.92 38.41,31.74 R59.1
  Top 0.254: 31.41,25.69 v31.5,25.6
  Bottom 0.203: v31.5,25.6 31.5,28.25 33.73,30.48 33.73,31.09 36.58,33.93 36.58,34.95 37.19,35.56 37.8,35.56 38.41,34.75 v38.41,32.92 38.41,32.72
N$61
  Top 0.305: JP4.3 8.23,46.84 8.33,46.94 10.36,46.94 10.67,47.24 10.67,47.41 R8.1
N$62
  Top 0.305: JP4.2 8.29,46.19 8.43,46.33 9.92,46.33 R9.1
N$67
  Top 0.203: IC8.4 29.66,24.38 27.43,22.15 R64.2 27.39,21.78 28.04,21.13 28.04,19.1 27.43,18.49 27.16,18.49 Q3.1 26.28,18.05 C59.1
N$68
  Top 0.203: IC8.5 30.16,23.66 29.26,22.76 29.26,22.32 R64.1 29.09,20.35 Q3.2 29.27,20.31 30.28,19.3 30.28,18.86 C58.1
N$78
  Top 0.254: IC7.4 32.24,38.91 R51.1
N$80
  Top 0.203: R14.1 25.44,3.25 25.44,5.04 24.38,6.1 23.4,6.1 LED5.A
N$84
  Top 0.203: R13.1 18.45,3.29 15.65,6.1 9.17,6.1 LED4.A
N$85
  Top 0.203: R12.1 17.68,4.88 15.24,7.32 7.52,7.32 7.11,6.91 LED3.A
N$86
  Top 0.203: LED2.A 4.47,7.11 5.08,7.72 16.87,7.72 17.88,6.71 R11.1
N$87
  Top 0.203: R10.1 17.48,8.53 17.07,8.13 3.05,8.13 1.83,6.91 LED1.A
RD+
  Top 0.203: IC8.23 21.91,26.99 21.74,26.82 17.68,26.82 15.24,29.26 15.24,32.89 RJ1.RD+ 21.21,34.87 21.54,34.54 C56.1 R56.2
RD-
  Top 0.203: IC8.22 21.59,27.49 21.34,27.23 17.88,27.23 15.65,29.46 15.65,30.28 16.43,31.06 RJ1.RD- 22.17,31.06 22.35,30.89 R57.2 24.96,29.34 C57.1
RTCK  (via drill 0.38)
  Top 0.203: JTAG2.7 50.6,7.11 50.6,5.28 52.43,5.28 52.83,5.69 52.83,11.99 51.41,13.41 v50.9,13.41 | IC1.100 42.06,27.23 42.47,27.23 42.67,27.03 42.67,26.01 43.28,25.4 43.28,12.6 v43.79,12.09
  Bottom 0.203: v50.9,13.41 50.7,13.51 48.87,13.51 48.36,13.01 46.23,13.01 45.92,13.31 45.01,13.31 v43.79,12.09
RX_0  (via drill 0.38)
  Top 0.203: IC1.99 40.93,27.72 40.64,27.43 40.64,27.03 42.88,24.79 v42.88,11.68
  Bottom 0.203: v42.88,11.68 42.77,11.68 43.48,10.77 65.23,10.77 65.63,11.18 JP3.4
SCL  (via drill 0.38)
  Top 0.203: IC1.24 55.23,24.42 55.88,23.77 v57.4,23.77
  3.3 0.203: U1.SCL1 18.9,50.7 18.9,49.78 19.91,48.77 22.76,48.77 24.79,46.74 24.79,41.86 25.4,41.25 42.06,41.25 42.88,40.44 42.88,36.98 56.19,23.67 57.51,23.67 v57.4,23.77
SD_CS  (via drill 0.38)
  Top 0.203: IC1.79 44.12,37.72 v44.2,37.59 | X1.2 20.76,17.34 v22.55,15.54
  Bottom 0.203: v44.2,37.59 44.2,37.08 56.29,24.99 56.29,23.27 56.69,22.86 56.69,21.74 51.82,16.87 33.93,16.87 32.72,15.65 22.66,15.65 v22.55,15.54
SD_MISO  (via drill 0.38)
  Top 0.203: v61.57,22.96 60.45,21.84 54.76,21.84 v54.56,21.95 | IC1.77 40.15,38.72 v40.03,38.61 | v19,19.91 12.8,19.91 11.79,18.9 11.79,12.6 12.54,11.84 X1.7
  3.3 0.203: v61.57,22.96 61.57,28.35 62.99,29.77 U1.MISO
  Bottom 0.203: v40.03,38.61 40.44,38.2 41.25,38.2 54.46,24.99 54.46,23.16 54.56,23.06 v54.56,21.95 54.56,21.44 51.21,18.09 33.33,18.09 32.11,16.87 23.57,16.87 20.52,19.91 v19,19.91
SD_MOSI  (via drill 0.38)
  Top 0.203: U1.MOSI 65.53,27.94 64.21,26.62 62.59,26.62 61.37,25.4 61.37,24.38 59.54,22.55 v55.98,22.55 | v40.44,40.23 40.44,39.42 40.64,39.22 IC1.76 | X1.3 20.74,16.24 v21.44,15.54
  Bottom 0.203: 55.88,22.35 55.88,24.79 v40.44,40.23 | 55.88,22.35 55.88,21.54 51.61,17.27 33.73,17.27 32.51,16.05 23.16,16.05 22.96,16.26 22.15,16.26 v21.44,15.54 | v55.98,22.55 55.88,22.35
SD_SCK  (via drill 0.38)
  Top 0.203: v55.17,23.47 55.27,23.37 56.69,23.37 57,23.06 59.44,23.06 60.96,24.59 60.96,25.81 62.99,27.84 63.52,27.84 U1.SCK | IC1.78 41.07,38.22 40.74,37.9 39.52,37.9 39.22,38.2 v39.22,39.42 | X1.5 16.27,14.04 17.27,15.04 19.1,15.04 v19.41,15.14
  Bottom 0.203: v39.22,39.42 40.64,39.42 55.17,24.89 v55.17,23.47 55.27,23.37 55.27,21.54 51.41,17.68 33.53,17.68 32.31,16.46 23.37,16.46 23.16,16.66 20.93,16.66 v19.41,15.14
SDA  (via drill 0.38)
  Top 0.203: IC1.25 55.73,24.53 55.88,24.38 56.69,24.38 v57,24.69
  3.3 0.203: U1.SDA1 25.2,46.94 25.2,42.06 25.6,41.66 42.27,41.66 43.28,40.64 43.28,37.19 56.08,24.38 56.69,24.38 v57,24.69
SERVO1  (via drill 0.38)
  Top 0.203: IC1.27 60.03,27.72 v60.35,28.04
  3.3 0.203: v60.35,28.04 60.15,27.84 59.54,27.84 51.21,36.17 51.21,47.35 53.34,49.48 U1.4
SERVO2  (via drill 0.38)
  Top 0.203: IC1.26 60.15,27.22 v60.35,27.03
  3.3 0.203: U1.5 50.8,35.97 59.74,27.03 v60.35,27.03
SERVO3  (via drill 0.38)
  Top 0.203: IC1.68 47.23,41.75 47.35,41.86 47.35,44.91 v47.75,45.31
  3.3 0.203: v47.75,45.31 48.26,45.82 U1.6
SERVO4  (via drill 0.38)
  Top 0.203: IC1.69 46.73,41.86 46.94,42.06 46.94,44.91 v46.53,45.31
  3.3 0.203: v46.53,45.31 45.72,46.13 U1.7
SPAREIO_0
  Top 0.203: IC1.66 48.23,42.75 51.21,45.72 88.59,45.72 92.46,49.58 95.2,49.58 U1.23
SPAREIO_1
  Top 0.203: IC1.65 48.73,42.64 51.41,45.31 90.83,45.31 92.46,46.94 95.3,46.94 U1.25
SPAREIO_2  (via drill 0.38)
  Top 0.203: IC1.62 50.23,42.31 52.02,44.09 69.7,44.09 70.71,43.08 71.73,43.08 72.34,43.69 v89.41,43.69
  Bottom 0.203: v89.41,43.69 91.85,43.69 92.66,44.5 95.2,44.5 U1.27
SPAREIO_3
  Top 0.203: IC1.63 49.73,42.42 51.82,44.5 69.9,44.5 70.71,43.69 71.53,43.69 72.34,44.5 89.61,44.5 92.25,41.86 95.3,41.86 U1.29
SPAREIO_4  (via drill 0.38)
  Top 0.203: IC1.61 50.73,42.2 52.22,43.69 69.09,43.69 v69.49,43.28 | U1.31 95.2,39.42 92.25,39.42 91.64,38.81 76.4,38.81 75.39,37.8 v74.37,37.8
  Bottom 0.203: v69.49,43.28 69.49,39.83 70.31,39.01 73.15,39.01 v74.37,37.8
SPAREIO_5  (via drill 0.38)
  Top 0.203: IC1.60 51.23,42.09 52.43,43.28 68.07,43.28 68.89,42.47 79.05,42.47 v79.25,42.67 | v79.25,36.78 95.3,36.78 U1.33
  Bottom 0.203: v79.25,42.67 v79.25,36.78
SPAREIO_6
  Top 0.203: IC1.37 58.72,32.72 58.73,32.72 91.03,32.72 92.66,34.34 95.2,34.34 U1.35
SPAREIO_7
  Top 0.203: IC1.36 58.64,32.22 58.73,32.31 90.83,32.31 91.44,31.7 95.3,31.7 U1.37
SPAREIO_8  (via drill 0.38)
  Top 0.203: IC1.43 58.89,35.72 60.35,37.19 67.67,37.19 68.07,36.78 72.95,36.78 74.98,34.75 88.59,34.75 v88.8,34.54
  Bottom 0.203: U1.39 95.2,29.26 91.85,29.26 88.8,32.31 v88.8,34.54
STP1  (via drill 0.38)
  Top 0.203: IC1.75 43.73,41.2 43.28,41.66 43.28,44.3 42.47,45.11 42.47,45.92 43.08,46.53 65.43,46.53 v66.24,47.35 | U1.38 93.88,27.84 72.54,27.84 71.32,29.06 v71.32,29.26
  Bottom 0.203: v66.24,47.35 66.24,33.53 68.48,31.29 70.31,31.29 71.32,30.28 v71.32,29.26
STP2  (via drill 0.38)
  Top 0.203: U1.A2 55.88,3.45 54.05,5.28 54.05,13.82 v54.25,14.02 | IC1.74 44.23,39.48 v44.5,39.22
  Bottom 0.203: v54.25,14.02 54.25,15.04 59.74,20.52 59.74,25.4 57.51,27.64 56.69,27.64 55.07,29.26 55.07,31.39 54.05,32.41 52.43,32.41 49.38,35.56 48.36,36.58 48.36,38.3 47.04,39.62 44.91,39.62 v44.5,39.22
STP3  (via drill 0.38)
  Top 0.203: IC1.73 44.73,42.03 44.6,42.16 44.09,42.16 43.69,42.57 43.69,44.91 v43.28,45.31
  3.3 0.203: v43.28,45.31 42.06,45.31 39.22,48.16 39.22,50.8 U1.9
STP4  (via drill 0.38)
  Top 0.203: IC1.70 46.23,44.6 45.82,45.01 45.82,45.92 46.02,46.13 66.24,46.13 67.26,47.14 v67.56,47.14 | U1.30 93.88,38.2 91.85,38.2 91.64,38.41 77.42,38.41 76,36.98 73.76,36.98 72.95,37.8 v71.73,37.8
  Bottom 0.203: v67.56,47.14 68.28,46.94 68.28,39.83 70.31,37.8 v71.73,37.8
TCK-SWDCLK
  Top 0.203: JTAG2.4 47.95,12.6 47.75,12.8 46.94,12.8 44.91,14.83 44.91,23.77 45.72,24.59 45.72,25.4 IC1.5
TD+  (via drill 0.38)
  Top 0.203: C54.1 R54.2 19.23,39.42 RJ1.TD+ | IC8.21 21.59,27.99 v21.34,28.25
  Bottom 0.203: v21.34,28.25 21.34,28.04 20.52,27.23 17.88,27.23 15.24,29.87 15.24,35.43 RJ1.TD+
TD-  (via drill 0.38)
  Top 0.203: RJ1.TD- 20.34,36.14 20.73,36.17 C55.1 R55.2 | IC8.20 26.25,28.49 26.21,28.45 22.55,28.45 v21.95,29.06
  Bottom 0.203: v21.95,29.06 21.95,33.96 RJ1.TD-
TDI  (via drill 0.38)
  Top 0.203: JTAG2.8 50.6,10.97 50.6,11.79 49.58,12.8 v49.17,12.8 | v45.52,12.6 44.09,14.02 44.09,24.18 44.23,24.32 IC1.2
  Bottom 0.203: v49.17,12.8 48.97,12.6 v45.52,12.6
TDO-SWO
  Top 0.203: JTAG2.6 49.17,10.77 49.17,9.96 48.36,9.14 46.33,9.14 45.72,9.75 45.72,11.28 43.69,13.31 43.69,24.38 43.73,24.43 IC1.1
TMS-SWDIO
  Top 0.203: IC1.3 44.7,25.4 44.7,24.18 44.5,23.98 44.5,14.63 46.74,12.39 46.74,10.97 JTAG2.2
TOOL1_AIN  (via drill 0.38)
  Top 0.203: IC1.9 47.73,24.2 48.36,23.57 48.36,20.52 47.75,19.91 47.75,16.66 47.95,16.46 80.47,16.46 v82.91,14.02
  Bottom 0.203: U1.A12 83.92,2.64 83.92,11.58 82.91,12.6 v82.91,14.02
TOOL1_DOUT  (via drill 0.38)
  Top 0.203: IC1.39 58.53,33.72 58.73,33.53 68.58,33.53 70.21,35.15 72.14,35.15 v72.34,34.95 | v80.26,22.96 93.88,22.96 U1.42
  Bottom 0.203: v72.34,34.95 74.78,34.95 80.47,29.26 80.47,23.16 v80.26,22.96
TOOL2_AIN  (via drill 0.38)
  Top 0.203: IC1.8 47.23,24.09 47.95,23.37 47.95,20.73 47.35,20.12 47.35,16.26 47.55,16.05 79.05,16.05 84.53,10.57 v85.75,10.57
  Bottom 0.203: U1.A13 86.36,9.96 v85.75,10.57
TOOL2_DOUT  (via drill 0.38)
  Top 0.203: v59.64,35.46 60.66,35.46 61.06,35.87 61.06,36.27 61.16,36.37 67.26,36.37 67.87,35.76 72.75,35.76 74.98,33.53 v85.55,33.53 | IC1.82 48.31,36.22 48.97,35.56 53.34,35.56 v53.44,35.66
  Bottom 0.203: v59.64,35.46 53.65,35.46 v53.44,35.66 | v85.55,33.53 85.55,20.73 85.95,20.32 85.95,14.22 87.38,12.8 93.88,12.8 U1.50
TOOL3_AIN
  Top 0.203: U1.A15 91.44,3.05 78.84,15.65 47.14,15.65 46.94,15.85 46.94,20.32 47.55,20.93 47.55,23.16 46.73,23.98 IC1.7
TOOL3_DOUT  (via drill 0.38)
  Top 0.203: IC1.47 58.45,37.72 58.73,38 58.73,38.61 58.93,38.81 66.85,38.81 67.46,39.42 75.18,39.42 75.79,40.03 80.06,40.03 82.7,42.67 v84.33,42.67
  Bottom 0.203: U1.22 92.96,48.26 90.42,45.72 87.78,45.72 84.73,42.67 v84.33,42.67
TOOL4_AIN
  Top 0.203: U1.A14 76.71,14.73 76.4,15.04 76.2,15.24 46.94,15.24 46.53,15.65 46.53,20.52 47.14,21.13 47.14,22.96 46.23,23.87 IC1.6
TOOL4_DOUT  (via drill 0.38)
  Top 0.203: 55.81,40.97 56.49,41.66 65.84,41.66 67.26,40.23 73.56,40.23 74.78,41.45 v77.42,41.45
  Top 0.254: IC1.51 55.81,40.97
  Bottom 0.203: v77.42,41.45 77.42,49.48 U1.18
TX_0  (via drill 0.38)
  Top 0.203: IC1.98 40.82,28.22 40.03,27.43 40.03,27.03 42.47,24.59 42.47,12.8 v42.06,12.39
  Bottom 0.203: v42.06,12.39 42.06,11.38 43.08,10.36 67.46,10.36 68.07,10.97 68.07,12.8 JP3.5
USB_CONNECT  (via drill 0.38)
  Top 0.203: v48.36,39.22 48.77,39.22 49.23,39.68 IC1.64 | Q1.3 33.31,46.72 32.92,46.33 32.92,43.89 33.53,43.28 36.78,43.28 v37.39,42.67
  3.3 0.203: v37.39,42.67 44.91,42.67 v48.36,39.22
USB_N  (via drill 0.38)
  Top 0.305: 60.13,30.39 v59.96,30.46 60.15,30.37 | v13.45,46.12 13.41,46.35 12.98,45.92 R9.2 C4.2 | IC1.30 58.48,29.22 arc45 59.38,29.59 60.15,30.37 | 60.15,30.37 arc-63 60.15,30.37
  Bottom 0.305: v59.96,30.46 60.13,30.39 arc45 60.2,30.42 61.22,31.44 arc45 61.59,32.34 61.59,38.37 arc45 61.22,39.27 56.49,44 arc90 55.83,44 55.5,43.66 arc-90 54.83,43.66 54.69,43.81 arc-90 54.69,44.48 55.02,44.81 arc90 55.02,45.47 52.99,47.51 arc45 52.09,47.88 30.21,47.88 | 29.31,47.51 arc-45 30.21,47.88 | v13.45,46.12 13.41,46.35 27.63,46.35 arc45 28.53,46.73 29.31,47.51 | 29.31,47.51 arc-45 30.21,47.88
USB_P  (via drill 0.38)
  Top 0.203: R7.1 13.55,47.24 v13.45,47.15
  Top 0.305: 60.57,29.96 v60.63,29.79 60.55,29.98 | v13.45,47.15 13.41,46.91 12.57,47.75 R8.2 12.03,49.38 C5.2 | IC1.29 58.77,28.72 arc45 59.67,29.09 60.55,29.98 | 60.55,29.98 arc63 60.55,29.98
  Bottom 0.305: v60.63,29.79 60.57,29.96 arc-45 60.59,30.02 61.78,31.21 arc45 62.15,32.11 62.15,38.6 arc45 61.78,39.5 53.22,48.07 arc45 52.32,48.44 29.98,48.44 | 29.08,48.07 arc-45 29.98,48.44 | v13.45,47.15 13.41,46.91 27.4,46.91 arc45 28.3,47.29 29.08,48.07 | 29.08,48.07 arc-45 29.98,48.44
VDD  (via drill 0.38)
  Top 0.203: R54.1 R55.1 | IC8.19 27.1,28.99 | R56.1 R57.1 25.03,31.86 24.99,31.9 | 26.21,31.9 26.21,31.94
  Top 0.305: RJ1.P5 17.91,32.33 19.18,33.6 RJ1.P4 21.46,31.9 24.99,31.9 26.21,31.9 | IC8.19 26.49,28.99 26.21,29.26 | IC8.1 28.16,25.32 27.23,24.38
  Top 0.406: 26.21,29.26 v26.21,29.67 26.21,31.9 | 27.23,24.38 v26.42,24.38 C46.1 | 26.21,31.94 26.21,32.31 26.62,32.72 27.19,32.72 C52.1 27.23,39.42 27.06,39.42 | R54.1 27.06,39.42 | 27.06,39.42 C53.1 | FB1.2 33.33,26.01 31.7,24.38 v31.5,24.38 33.33,22.55 C45.A
  pour 3.3 (isolate 0.254): 15.65,38.81 22.56,38.81 22.56,39.83 22.96,40.23 28.65,40.23 28.65,32.51 32.31,32.51 32.31,23.98 32.11,23.77 22.76,23.77 22.76,27.23 15.65,27.23
VSENSE  (via drill 0.38)
  Top 0.203: U1.A1 53.34,4.98 53.65,5.28 53.65,13.61 53.03,14.22 47.75,14.22 47.55,14.43 46.53,14.43 45.72,15.24 45.72,22.25 v46.02,22.55 | IC1.21 53.73,24.47 53.24,23.98 v53.24,23.27
  Bottom 0.203: v46.02,22.55 51,22.55 51.41,22.15 52.63,22.15 53.24,22.76 v53.24,23.27
VUSB
  Top 0.61: D1.A 25.64,45.31 25.43,45.52 PTC1.1
X_MIN  (via drill 0.38)
  Top 0.203: IC1.38 58.42,33.22 58.52,33.12 69.29,33.12 v69.6,33.43 | U1.A9 76.2,10.97 v73.36,13.82
  Bottom 0.203: v73.36,13.82 73.36,30.07 70,33.43 v69.6,33.43
Y_MIN  (via drill 0.38)
  Top 0.203: IC1.40 58.64,34.22 58.93,33.93 67.87,33.93 v68.89,34.95 | U1.A10 78.74,9.45 v74.78,13.41
  Bottom 0.203: v74.78,13.41 76.2,14.83 76.2,30.48 73.76,32.92 71.32,32.92 70.31,33.93 70.31,34.95 70.1,35.15 68.89,35.15 v68.89,34.95
Z_MIN  (via drill 0.38)
  Top 0.203: IC1.44 58.78,36.22 60.15,37.59 v68.68,37.59 | U1.A11 81.28,8.33 v76.61,13.01
  Bottom 0.203: v68.68,37.59 69.09,37.59 70.92,35.76 70.92,34.14 71.73,33.33 74.17,33.33 76.61,30.89 v76.61,13.01

## Text on the board
tPlace: RST | Rev A | ISP | (Smoothie Compatible) | Black | EARM01 CPU Module
bPlace: Rev A | RST | ISP | (Smoothie Compatible) | Black | EARM01 CPU Module | 4 3 2 1